# Altium schematic sheet Motor Driver.SchDoc
size A2
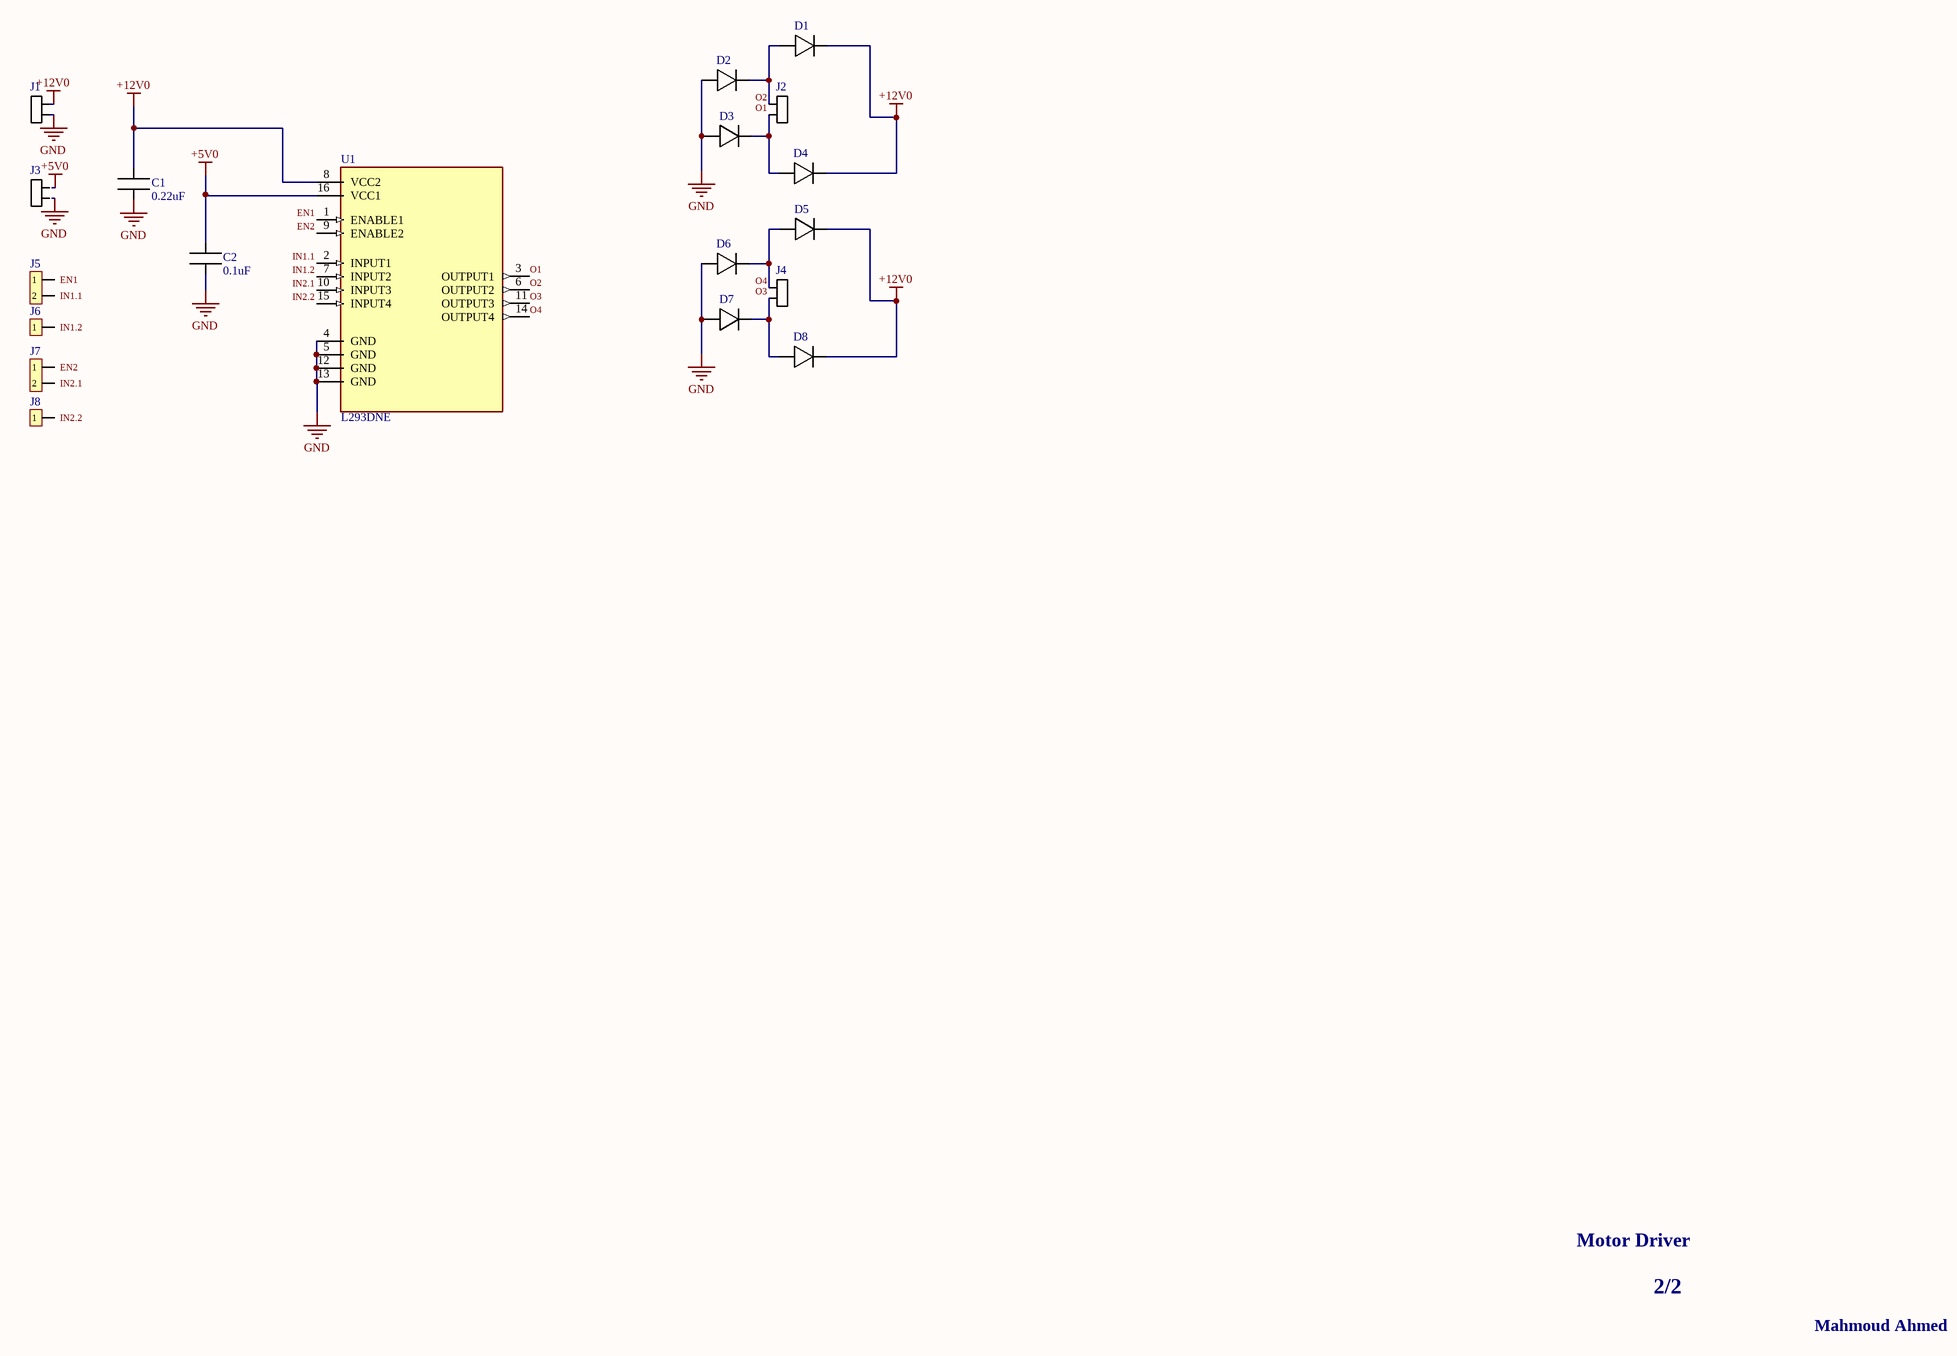
[diagram p0: Motor Driver.SchDoc]

## Parts
C1  0.22uF  [C0805]
C2  0.1uF  [C0805]
D1  1N4007G  [1N4007]  (value not drawn)
D2  1N4007G  [1N4007]  (value not drawn)
D3  1N4007G  [1N4007]  (value not drawn)
D4  1N4007G  [1N4007]  (value not drawn)
D5  1N4007G  [1N4007]  (value not drawn)
D6  1N4007G  [1N4007]  (value not drawn)
D7  1N4007G  [1N4007]  (value not drawn)
D8  1N4007G  [1N4007]  (value not drawn)
J1  102-6179-ND  [Terminal block]  (value not drawn)
J2  102-6179-ND  [Terminal block]  (value not drawn)
J3  102-6179-ND  [Terminal block]  (value not drawn)
J4  102-6179-ND  [Terminal block]  (value not drawn)
J5  68000-202HLF  [HDR 1x2M]  (value not drawn)
J6  PH1-01-UA  [HDR 1x1M]  (value not drawn)
J7  68000-202HLF  [HDR 1x2M]  (value not drawn)
J8  PH1-01-UA  [HDR 1x1M]  (value not drawn)
U1  L293DNE  [L293D]

## Nets
+5V0: C2.2 U1.16(VCC1)
+12V0: C1.2 D1.1(cathode) D4.1(cathode) D5.1(cathode) D8.1(cathode) J1.1 U1.8(VCC2)
GND: C1.1 C2.1 D2.2(Anode) D3.2(Anode) D6.2(Anode) D7.2(Anode) J1.2 U1.4(GND) U1.5(GND) U1.12(GND) U1.13(GND)
EN1: U1.1(ENABLE1)
EN2: U1.9(ENABLE2)
IN1.1: U1.2(INPUT1)
IN1.2: U1.7(INPUT2)
IN2.1: U1.10(INPUT3)
IN2.2: U1.15(INPUT4)
O1: D3.1(cathode) D4.2(Anode) J2.2 U1.3(OUTPUT1)
O2: D1.2(Anode) D2.1(cathode) J2.1 U1.6(OUTPUT2)
O3: D7.1(cathode) D8.2(Anode) J4.2 U1.11(OUTPUT3)
O4: D5.2(Anode) D6.1(cathode) J4.1 U1.14(OUTPUT4)

Not connected (* = marked no-connect by the designer): J3 1(*) 2(*); J5 1 2; J6 1; J7 1 2; J8 1

## Notes on the sheet
- Motor Driver
- 2/2
- Mahmoud Ahmed
- Labels drawn without touching a wire or pin: EN1, EN2, IN1.1, IN1.2, IN2.1, IN2.2

## Library data of the parts
C1 = 0.22uF CAP: CAP CER 0.22UF 25V X7R 0805; MPN: CC0805KRX7R8BB224; Manufacturer: YAGEO; SPN: 311-1432-1-ND; Supplier: DigiKey
C2 = 0.1uF CAP: CAP CER 0.1UF 50V X7R 0805; Manufacturer: TDK Corporation; MPN: C2012X7R1H104K085AA; SPN: 445-7534-1-ND; Supplier: DigiKey
D1-D8 = 1N4007: DIODE GEN PURP 1A DO204AL; Manufacturer: Taiwan Semiconductor Corporation; SPN: 1801-1N4007GCT-ND; MPN: 1N4007G; Supplier: DigiKey
J1-J4 = Terminal block: TERMINAL BLOCK, SCREW TYPE, 5.08; MPN: TB004-508-02BE; Manufacturer: CUI Devices; Supplier: DigiKey; Parameter 1: 102-6179-ND
J5 J7 = HDR 1x2M: CONN HEADER VERT 2POS 2.54MM; Manufacturer: Amphenol ICC (FCI); SPN: 609-3502-ND; MPN: 68000-202HLF; Supplier: DigiKey
J6 J8 = HDR 1x1M: CONN HEADER VERT 1POS 2.54MM; Manufacturer: Adam Tech; SPN: 2057-PH1-01-UA-ND; MPN: PH1-01-UA; Supplier: DigiKey
U1 = L293DNE: IC MTR DRV BIPOLAR 4.5-36V 16DIP; Manufacturer: Texas Instruments; SPN: 296-9518-5-ND; MPN: L293DNE; Supplier: DigiKey